# Altium schematic sheet Power_P2V5.SchDoc
size A4; CompanyName: WEITI ISE; Address1: ul. Nowowiejska 15/19; Address2: 00-665 Warszawa; DocumentNumber: 6; SheetNumber: 6; SheetTotal: 7
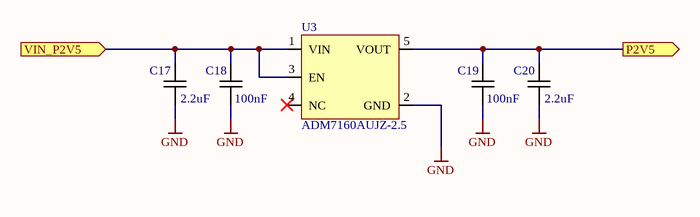
[diagram p0: Power_P2V5.SchDoc]

## Parts
C17  2.2uF  [CAPC0603X90N]
C18  100nF  [CAPC0603X90N]
C19  100nF  [CAPC0603X90N]
C20  2.2uF  [CAPC0603X90N]
U3  ADM7160AUJZ-2.5

## Ports
P2V5 (out), VIN_P2V5 (in)

## Nets
GND: C17.2 C18.2 C19.2 C20.2 U3.2(GND)
P2V5: C19.1 C20.1 U3.5(VOUT) ; port P2V5
VIN_P2V5: C17.1 C18.1 U3.1(VIN) U3.3(EN) ; port VIN_P2V5

Not connected (* = marked no-connect by the designer): U3 4(NC)*

## Notes on the sheet
- Project:
- Title
- File:
- Drawn by:
- Engineer:
- Checked by:
- Szymon Jedliński
- Sheet:
- Revision:
- Total Sheet:
- 1.0
- Variant:
- Approved by:
- Date:

## Library data of the parts
C17 C20 = CC0603_2U2F_16V_10%_X7R: Non-polarised capacitor; Manufacturer Part Number: GRM188Z71C225KE43D; DesignItemId: CC0603_2U2F_16V_10%_X7R; HelpURL: https://www.mouser.pl/datasheet/2/281/1/GRM188Z71C225KE43_01A-1985990.pdf; Height: 0.8mm; SMD: Yes; Value: 2.2uF
C18 C19 = CC0603_100NF_16V_10%_X7R: Non-polarised capacitor; Manufacturer Part Number: VJ0603Y104KXJCW1BC; DesignItemId: CC0603_100NF_16V_10%_X7R; HelpURL: https://www.vishay.com/docs/28548/vjw1bcbascomseries.pdf; Height: 0.8mm; SMD: Yes; Value: 100nF
U3 = ADM7160AUJZ-2.5: Ultralow Noise, 200 mA Linear Regulator, 2.5V out; Manufacturer 1 Component Height: 1mm; DesignItemId: ADM7160AUJZ-2.5; Device: ADM7160AUJZ-2.5; HelpURL: https://www.mouser.pl/datasheet/2/609/ADM7160-3120776.pdf; SMD: Yes